# EAGLE schematic Slave (EAGLE 9.6.2)
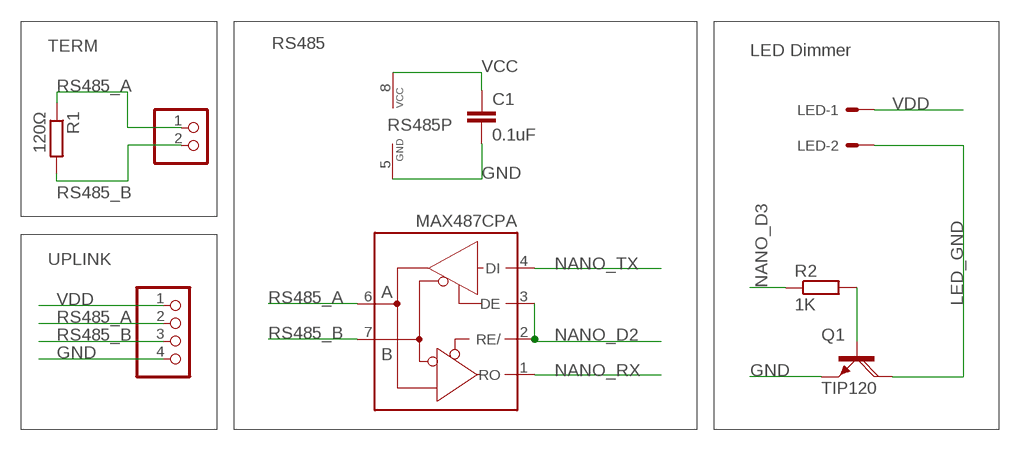
[diagram p0: schematic, sheet 1]

## Parts
C1  0.1uF  C-EU025-025X050  [C025-025X050]
LED  KK-156-2  [KK-156-2]
Q1  TIP120  [TO220AH]
R1  120Ω  R-EU_0207/10  [0207/10]
R2  1K  R-EU_0207/10  [0207/10]
RS485  MAX487CPA  [DIL08]
TERM  PINHD-1X2  [1X02]
UPLINK  PINHD-1X4  [1X04]

## Nets
GND: C1.2 Q1.E RS485.5(GND) UPLINK.4
LED_GND: LED.2 Q1.C
N$2: Q1.B R2.2
NANO_D2: RS485.2(RE/) RS485.3(DE)
NANO_D3: R2.1
NANO_RX: RS485.1(RO)
NANO_TX: RS485.4(DI)
RS485_A: R1.1 RS485.6(A) TERM.1 UPLINK.2
RS485_B: R1.2 RS485.7(B) TERM.2 UPLINK.3
VCC: C1.1 RS485.8(VCC)
VDD: LED.1 UPLINK.1

## Notes on the sheet
- LED Dimmer

## Library data of the parts
C1 = rcl:C-EU: CAPACITOR, European symbol; SPICEPREFIX: C
LED = con-molex:KK-156-2: KK 156 HEADER Source: http://www.molex.com/pdm_docs/sd/026604100_sd.pdf; MF: MOLEX; OC_FARNELL: unknown; OC_NEWARK: unknown
Q1 = transistor-power:TIP120: NPN DARLINGTON TRANSISTOR
R1 R2 = rcl:R-EU_: RESISTOR, European symbol; SPICEPREFIX: R
RS485 = A10 Library:MAX487CPA: RS485 TRANSEIVER; MPN: MAX487CPA; OC_FARNELL: unknown; OC_NEWARK: unknown
TERM = pinhead:PINHD-1X2: PIN HEADER
UPLINK = pinhead:PINHD-1X4: PIN HEADER

## Net classes
0 default: width 0.406 mm, drill 0.254 mm, clearance 0.406 mm